# EAGLE design LatencyTester (EAGLE 6.5.0)
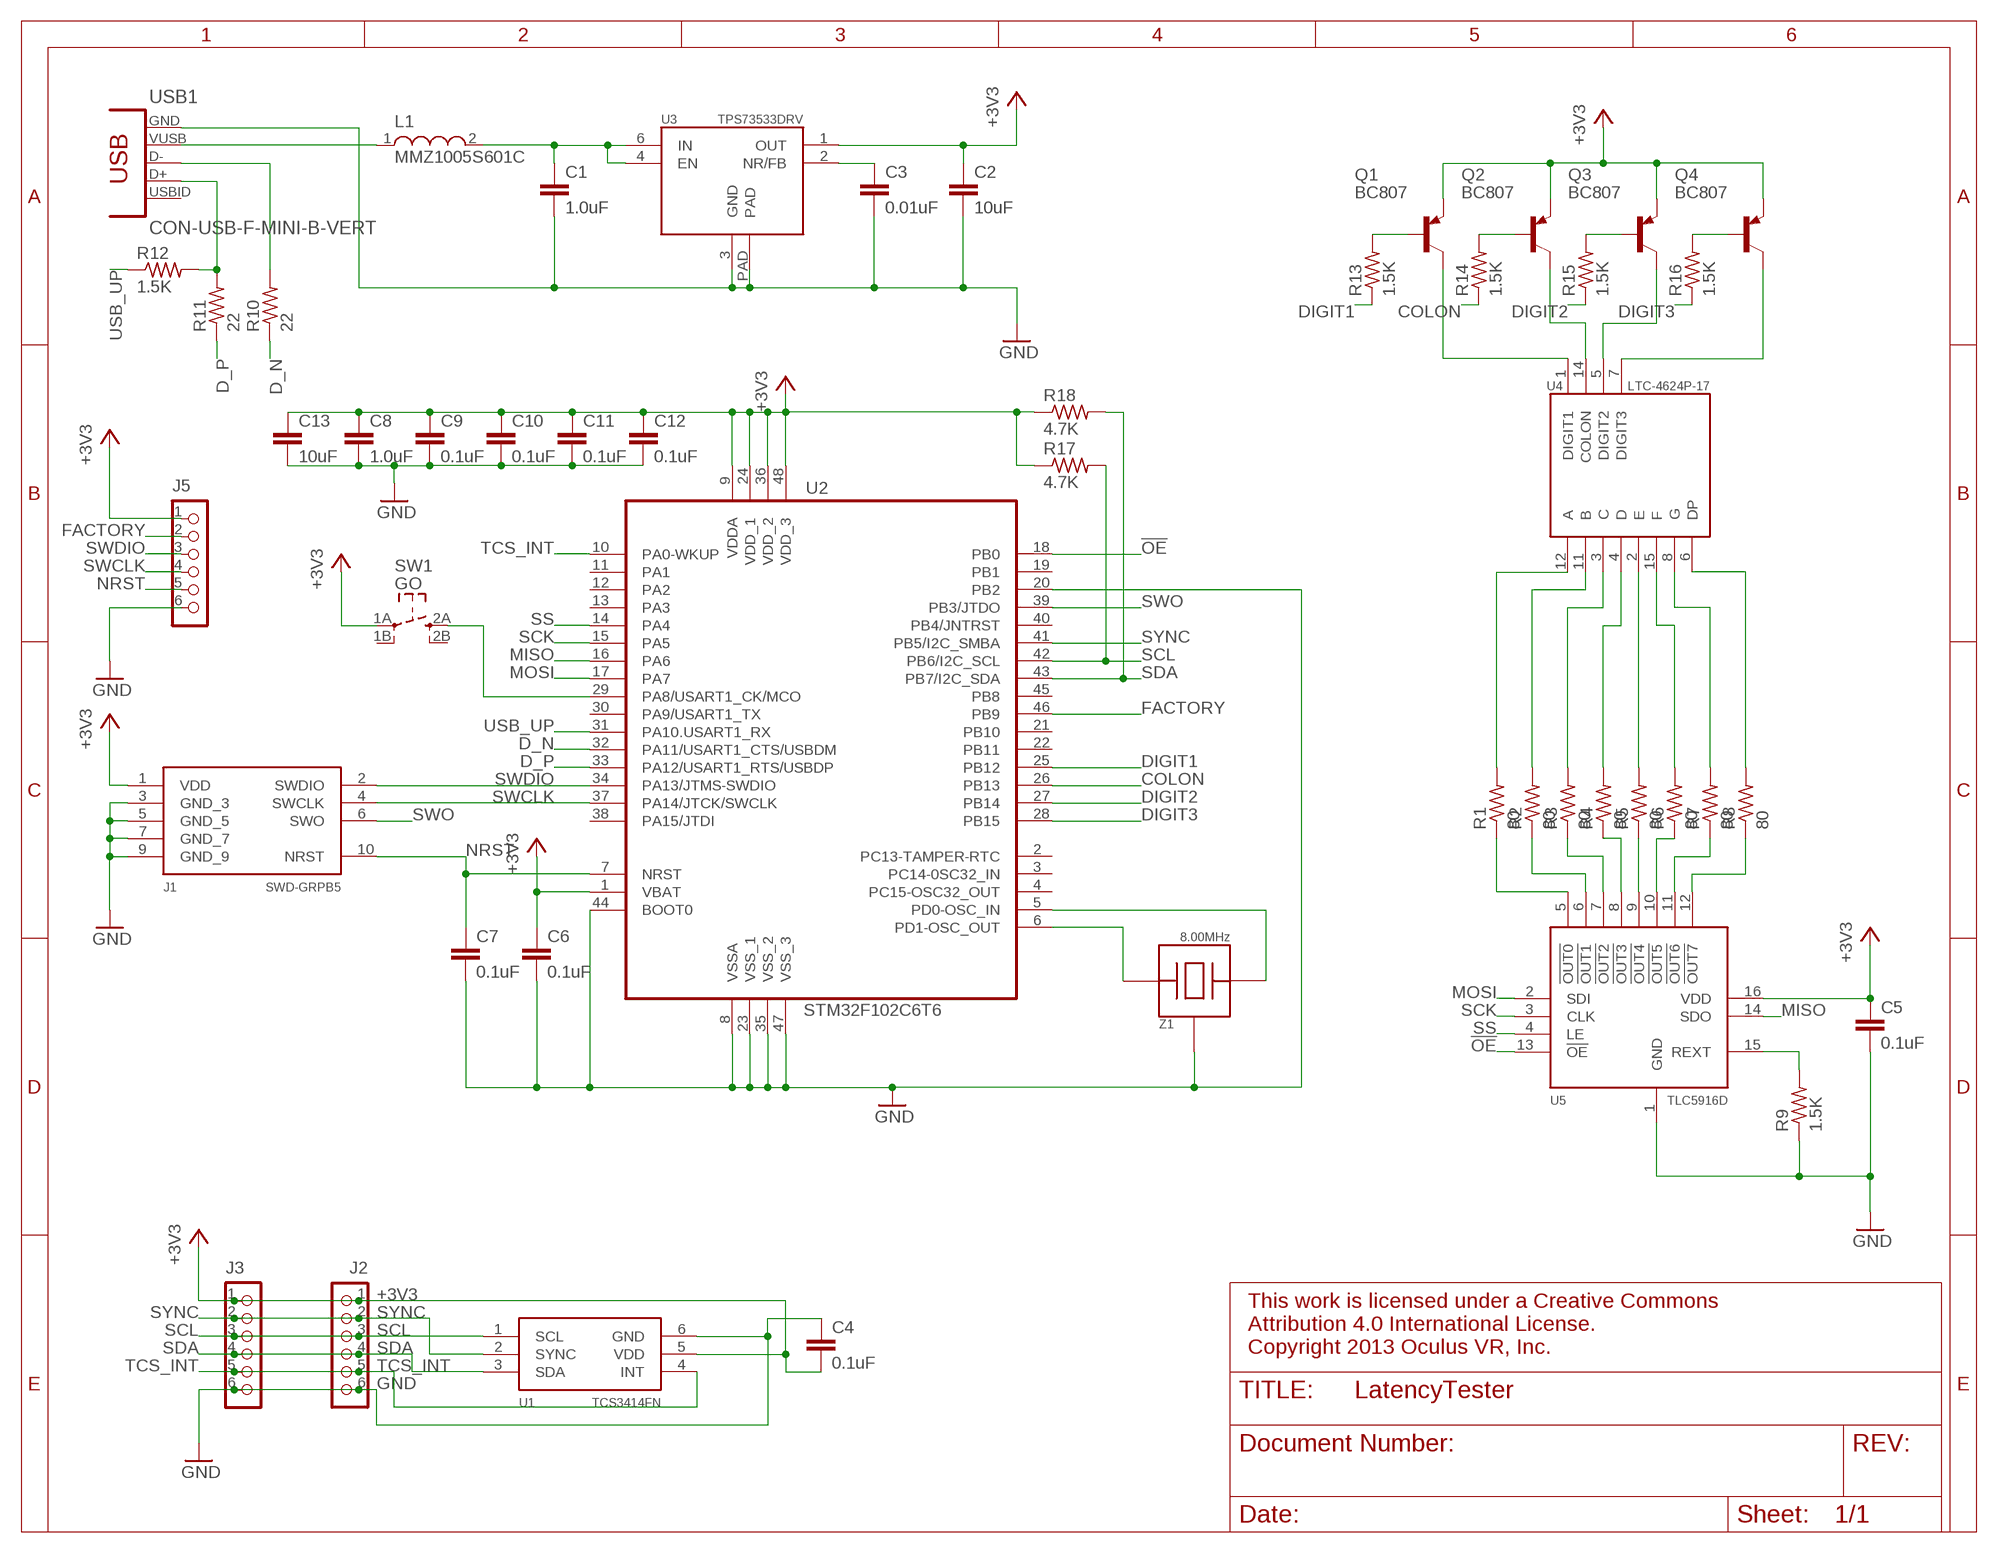
[diagram p0: schematic, sheet 1]

## Parts
C1  1.0uF  C-EUC0402  [C0402]
C2  10uF  C-EUC0805  [C0805]
C3  0.01uF  C-EUC0402  [C0402]
C4  0.1uF  C-EUC0402  [C0402]
C5  0.1uF  C-EUC0402  [C0402]
C6  0.1uF  C-EUC0402  [C0402]
C7  0.1uF  C-EUC0402  [C0402]
C8  1.0uF  C-EUC0402  [C0402]
C9  0.1uF  C-EUC0402  [C0402]
C10  0.1uF  C-EUC0402  [C0402]
C11  0.1uF  C-EUC0402  [C0402]
C12  0.1uF  C-EUC0402  [C0402]
C13  10uF  C-EUC0805  [C0805]
J1  SWD-GRPB5  [GRPB5]
J2  CON_HEADER_1X06-PTH  [M1X6]
J3  CON_HEADER_1X06-PTH  [M1X6]
J5  CON_HEADER_1X06-PTH  [M1X6]
L1  MMZ1005S601C  INDUCTOR-L0402  [C402]
Q1  BC807  TRANSISTOR_BJT_PNP-SOT-323  [SOT-323]
Q2  BC807  TRANSISTOR_BJT_PNP-SOT-323  [SOT-323]
Q3  BC807  TRANSISTOR_BJT_PNP-SOT-323  [SOT-323]
Q4  BC807  TRANSISTOR_BJT_PNP-SOT-323  [SOT-323]
R1  80  R-US_R0402  [R0402]
R2  80  R-US_R0402  [R0402]
R3  80  R-US_R0402  [R0402]
R4  80  R-US_R0402  [R0402]
R5  80  R-US_R0402  [R0402]
R6  80  R-US_R0402  [R0402]
R7  80  R-US_R0402  [R0402]
R8  80  R-US_R0402  [R0402]
R9  1.5K  R-US_R0402  [R0402]
R10  22  R-US_R0402  [R0402]
R11  22  R-US_R0402  [R0402]
R12  1.5K  R-US_R0402  [R0402]
R13  1.5K  R-US_R0402  [R0402]
R14  1.5K  R-US_R0402  [R0402]
R15  1.5K  R-US_R0402  [R0402]
R16  1.5K  R-US_R0402  [R0402]
R17  4.7K  R-US_R0402  [R0402]
R18  4.7K  R-US_R0402  [R0402]
SW1  GO  SW_TACT_4P-ADTS2  [ADTS2]
U1  TCS3414FN  [TCS3414FN]
U2  STM32F102C6T6  IC_UC_STM32  [LQFP48]
U3  TPS73533DRV  TPS735XXDRV  [SON-6]
U4  LTC-4624P-17  [LTC-4624]
U5  TLC5916D  [SOIC-16]
USB1  CON-USB-F-MINI-B-VERT  [651005136421]
Z1  8.00MHz  RESONATOR-PQRV-C  [PQRV]

## Nets
!OE: U2.18(PB0) U5.13(!OE)
+3V3: C2.1 C4.2 C5.1 C6.1 C8.1 C9.1 C10.1 C11.1 C12.1 C13.1 J1.1(VDD) J2.1 J3.1 J5.1 Q1.2(E) Q2.2(E) Q3.2(E) Q4.2(E) R17.1 R18.1 SW1.1A U1.5(VDD) U2.1(VBAT) U2.9(VDDA) U2.24(VDD_1) U2.36(VDD_2) U2.48(VDD_3) U3.1(OUT) U5.16(VDD)
COLON: R14.1 U2.26(PB13)
D1_N: R10.2 USB1.2(D-)
D1_P: R11.2 R12.2 USB1.3(D+)
D_N: R10.1 U2.32(PA11/USART1_CTS/USBDM)
D_P: R11.1 U2.33(PA12/USART1_RTS/USBDP)
DIGIT1: R13.1 U2.25(PB12)
DIGIT2: R15.1 U2.27(PB14)
DIGIT3: R16.1 U2.28(PB15)
FACTORY: J5.2 U2.46(PB9)
GND: C1.2 C2.2 C3.2 C4.1 C5.2 C6.2 C7.2 C8.2 C9.2 C10.2 C11.2 C12.2 C13.2 J1.3(GND_3) J1.5(GND_5) J1.7(GND_7) J1.9(GND_9) J2.6 J3.6 J5.6 R9.1 U1.6(GND) U2.8(VSSA) U2.20(PB2) U2.23(VSS_1) U2.35(VSS_2) U2.44(BOOT0) U2.47(VSS_3) U3.3(GND) U3.PAD U5.1(GND) USB1.5(GND) Z1.2(GND)
MISO: U2.16(PA6) U5.14(SDO)
MOSI: U2.17(PA7) U5.2(SDI)
N$1: R1.1 U5.5(!OUT0)
N$2: R2.1 U5.6(!OUT1)
N$3: R3.1 U5.7(!OUT2)
N$4: R4.1 U5.8(!OUT3)
N$5: R5.1 U5.9(!OUT4)
N$6: R6.1 U5.10(!OUT5)
N$7: R7.1 U5.11(!OUT6)
N$8: R8.1 U5.12(!OUT7)
N$9: R1.2 U4.12(A)
N$10: R2.2 U4.11(B)
N$11: R3.2 U4.3(C)
N$12: R4.2 U4.4(D)
N$13: R5.2 U4.2(E)
N$14: R6.2 U4.15(F)
N$15: R7.2 U4.8(G)
N$16: R8.2 U4.6(DP)
N$17: U2.6(PD1-OSC_OUT) Z1.1(IN)
N$18: U2.5(PD0-OSC_IN) Z1.3(OUT)
N$19: Q1.3(C) U4.1(DIGIT1)
N$20: Q2.3(C) U4.14(COLON)
N$21: Q3.3(C) U4.5(DIGIT2)
N$22: Q4.3(C) U4.7(DIGIT3)
N$24: SW1.2A U2.29(PA8/USART1_CK/MCO)
N$25: C3.1 U3.2(NR/FB)
N$26: R9.2 U5.15(REXT)
N$33: Q1.1(B) R13.2
N$34: Q2.1(B) R14.2
N$35: Q3.1(B) R15.2
N$36: Q4.1(B) R16.2
NRST: C7.1 J1.10(NRST) J5.5 U2.7(NRST)
SCK: U2.15(PA5) U5.3(CLK)
SCL: J2.3 J3.3 R17.2 U1.1(SCL) U2.42(PB6/I2C_SCL)
SDA: J2.4 J3.4 R18.2 U1.3(SDA) U2.43(PB7/I2C_SDA)
SS: U2.14(PA4) U5.4(LE)
SWCLK: J1.4(SWCLK) J5.4 U2.37(PA14/JTCK/SWCLK)
SWDIO: J1.2(SWDIO) J5.3 U2.34(PA13/JTMS-SWDIO)
SWO: J1.6(SWO) U2.39(PB3/JTDO)
SYNC: J2.2 J3.2 U1.2(SYNC) U2.41(PB5/I2C_SMBA)
TCS_INT: J2.5 J3.5 U1.4(INT) U2.10(PA0-WKUP)
USB_UP: R12.1 U2.31(PA10.USART1_RX)
VUSB: L1.1 USB1.1(VUSB)
VUSB_FILTERED: C1.1 L1.2 U3.4(EN) U3.6(IN)
Unconnected: SW1.1B SW1.2B U2.2(PC13-TAMPER-RTC) U2.3(PC14-0SC32_IN) U2.4(PC15-OSC32_OUT) U2.11(PA1) U2.12(PA2) U2.13(PA3) U2.19(PB1) U2.21(PB10) U2.22(PB11) U2.30(PA9/USART1_TX) U2.38(PA15/JTDI) U2.40(PB4/JNTRST) U2.45(PB8) USB1.4(USBID)

## Notes on the sheet
- This work is licensed under a Creative Commons 
  Attribution 4.0 International License.
  Copyright 2013 Oculus VR, Inc.

## Library data of the parts
C1-C13 = resistor:C-EU: CAPACITOR, European symbol
J1 = oculus:SWD
J2 J3 J5 = dp_devices:CON_HEADER_1X06
L1 = oculus:INDUCTOR: Inductor
Q1-Q4 = oculus:TRANSISTOR_BJT_PNP: From Dangerous Prototypes Most commonly used is SOT23-BEC
R1-R18 = resistor:R-US_: RESISTOR, American symbol
SW1 = oculus:SW_TACT_4P
U1 = oculus:TCS3414: TAOS Digital Color Sensor
U2 = dp_devices:IC_UC_STM32: STM32F102C6
U3 = oculus:TPS735XX: Texas Instruments 500mA, Low Quiescent Current, Ultra-Low Noise, High PSRR Low-Dropout Linear Regulator
U4 = oculus:LTC-4624: LITE-ON triple digit seven-segment display.
U5 = oculus:TLC5916: TI 8-channel constant-current led sink drivers.
USB1 = oculus:CON-USB-F: USB Female connector
Z1 = oculus:RESONATOR

## Net classes
0 default: clearance 0.355 mm

## Board
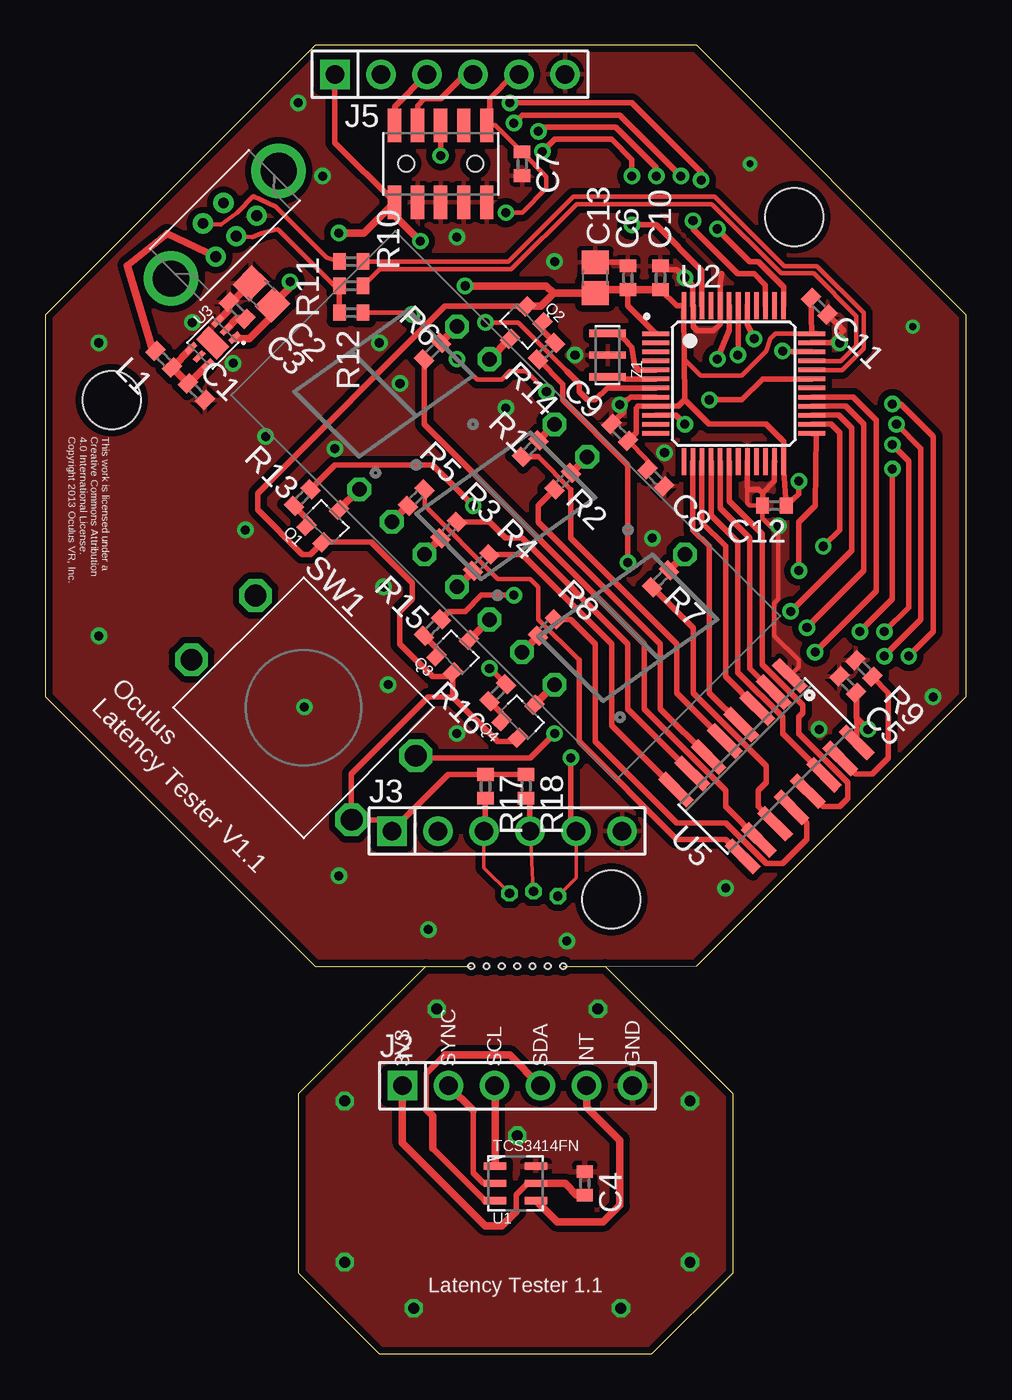
[diagram p1: board, top side]
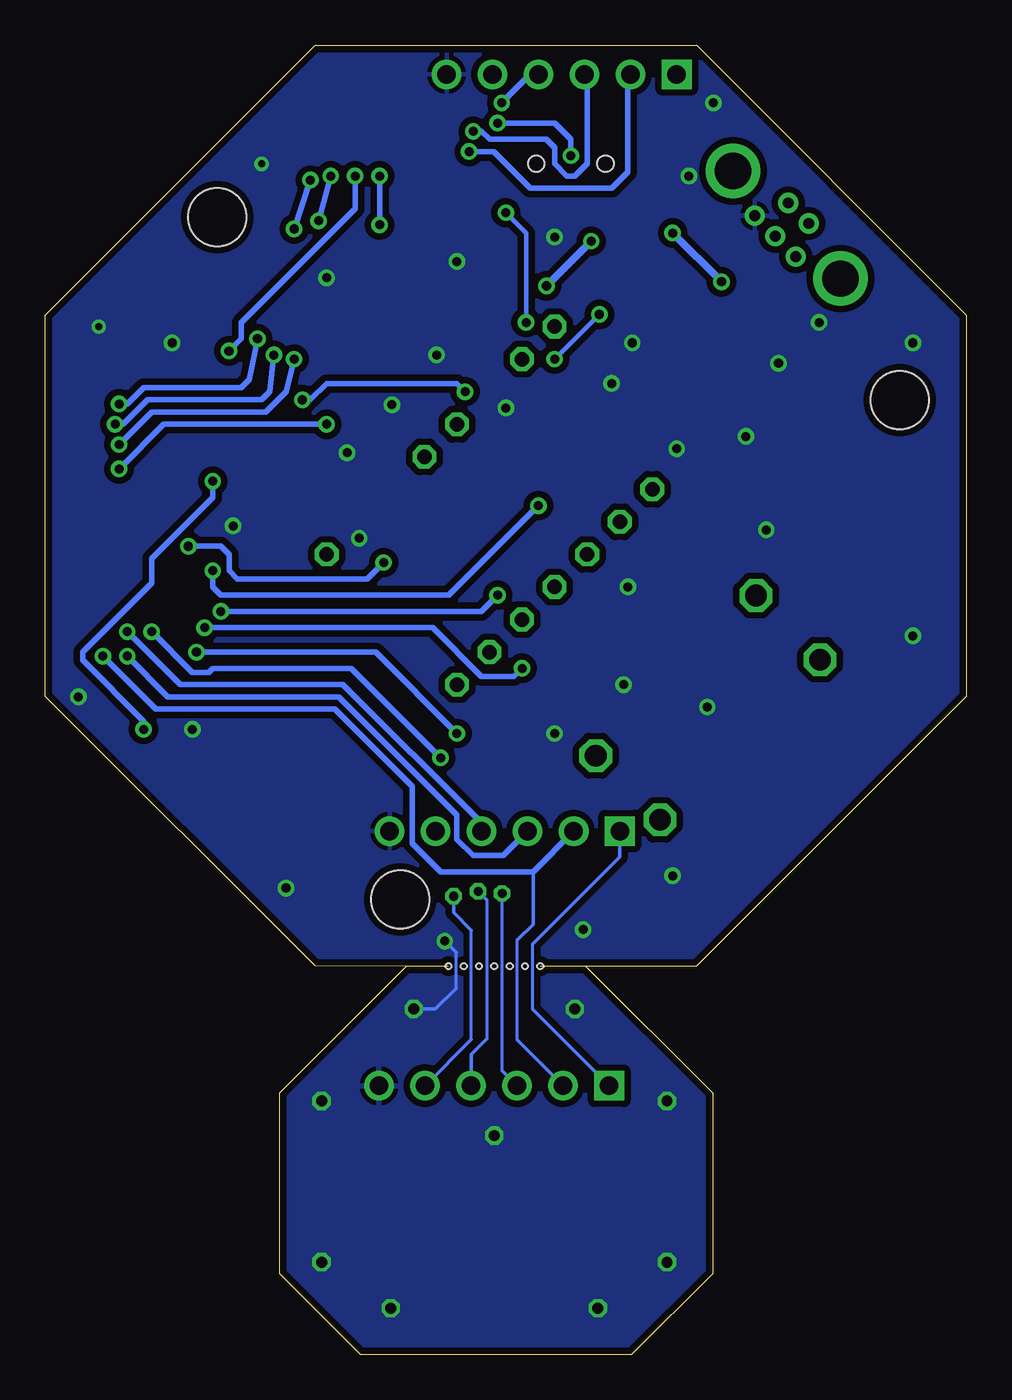
[diagram p2: board, bottom side, seen from below]

Size 50.8 x 72.22 mm. Coordinates in mm from the lower left corner, seen from the top.
Outline: 21,21.41 14.89,21.41 0,36.3 0,57.35 14.88,72.22 35.92,72.22 50.8,57.35 50.8,36.3 35.92,21.42 28.56,21.41 30.88,21.41 37.91,14.38 37.91,4.47 33.43,0 18.44,0 13.97,4.47 13.97,14.38 20.98,21.4 21,21.41
Outline: 21,21.41 23.49,21.41
Copper layers (1*16): Top 0.035559375mm / dielectric 1.501140625mm / Bottom 0.035559375mm
Design rules "typical_4pcb": minimum track width 10mil, minimum drill 15mil, track to track 6mil, track to pad 6mil, pad to pad 6mil, via to via 6mil, smd to smd 6mil, copper to edge 15mil, drill to drill 8mil, minimum pad ring 10mil, minimum via ring 8mil, stop-mask expansion 4mil, vias tented up to drill 0mil, thermal gap 10mil
Holes 0.33 mm at 26.03,21.41 26.87,21.41 25.18,21.41 24.34,21.41 23.49,21.41 28.56,21.41 27.72,21.41

### Footprints (pad centres in the part's own frame; a part is rotated, then mirrored left to right if it is on the bottom)
C0402 = smd 0.7 x 0.9: 1 -0.65,0; 2 0.65,0
C0805 = smd 1.3 x 1.5: 1 -0.85,0; 2 0.85,0
GRPB5 = smd 0.737 x 1.854: 1 -2.54,-2.121; 2 -2.54,2.121; 3 -1.27,-2.121; 4 -1.27,2.121; 5 0,-2.121; 6 0,2.121; 7 1.27,-2.121; 8 1.27,2.121; 9 2.54,-2.121; 10 2.54,2.121 | hole 0.9: -1.905,0; 1.905,0
M1X6 = drill 1.02 pad 1.632 square: 1 0,0 | drill 1.02 pad 1.632: 2 2.54,0; 3 5.08,0; 4 7.62,0; 5 10.16,0; 6 12.7,0
C402 = smd 0.7 x 0.9: 1 -0.65,0; 2 0.65,0
SOT-323 = smd 0.711 x 0.889: 1 -0.635,-0.953; 2 0.635,-0.953; 3 0,0.953
R0402 = smd 0.7 x 0.9: 1 -0.65,0; 2 0.65,0
ADTS2 = drill 1.2 octagon: 1A -6.248,2.502; 1B 6.248,2.502; 2A -6.248,-2.502; 2B 6.248,-2.502
TCS3414FN = smd 1.25 x 0.4: 1 -1.125,0.95; 2 -1.125,0; 3 -1.125,-0.95; 4 1.125,-0.95; 5 1.125,0; 6 1.125,0.95
LQFP48 = smd 1.5 x 0.25: 1 -4.3,2.75; 2 -4.3,2.25; 3 -4.3,1.75; 4 -4.3,1.25; 5 -4.3,0.75; 6 -4.3,0.25; 7 -4.3,-0.25; 8 -4.3,-0.75; 9 -4.3,-1.25; 10 -4.3,-1.75; 11 -4.3,-2.25; 12 -4.3,-2.75; 25 4.3,-2.75; 26 4.3,-2.25; 27 4.3,-1.75; 28 4.3,-1.25; 29 4.3,-0.75; 30 4.3,-0.25; 31 4.3,0.25; 32 4.3,0.75; 33 4.3,1.25; 34 4.3,1.75; 35 4.3,2.25; 36 4.3,2.75 | smd 0.25 x 1.5: 13 -2.75,-4.3; 14 -2.25,-4.3; 15 -1.75,-4.3; 16 -1.25,-4.3; 17 -0.75,-4.3; 18 -0.25,-4.3; 19 0.25,-4.3; 20 0.75,-4.3; 21 1.25,-4.3; 22 1.75,-4.3; 23 2.25,-4.3; 24 2.75,-4.3; 37 2.75,4.3; 38 2.25,4.3; 39 1.75,4.3; 40 1.25,4.3; 41 0.75,4.3; 42 0.25,4.3; 43 -0.25,4.3; 44 -0.75,4.3; 45 -1.25,4.3; 46 -1.75,4.3; 47 -2.25,4.3; 48 -2.75,4.3
SON-6 = smd 0.7 x 0.3: 1 -1.05,0.65; 2 -1.05,0; 3 -1.05,-0.65; 4 1.05,-0.65; 5 1.05,0; 6 1.05,0.65 | smd 1 x 1.6: PAD 0,0
LTC-4624 = drill 0.8 octagon: 1 -6.35,-5.08; 2 -3.81,-5.08; 3 -1.27,-5.08; 4 1.27,-5.08; 5 3.81,-5.08; 6 6.35,-5.08; 7 8.89,-5.08; 8 8.89,5.08; 11 1.27,5.08; 12 -1.27,5.08; 14 -6.35,5.08; 15 -8.89,5.08
SOIC-16 = smd 0.6 x 2.2: 1 -4.445,-2.6; 2 -3.175,-2.6; 3 -1.905,-2.6; 4 -0.635,-2.6; 5 0.635,-2.6; 6 1.905,-2.6; 7 3.175,-2.6; 8 4.445,-2.6; 9 4.445,2.6; 10 3.175,2.6; 11 1.905,2.6; 12 0.635,2.6; 13 -0.635,2.6; 14 -1.905,2.6; 15 -3.175,2.6; 16 -4.445,2.6
HOLE_3.2 = hole 3.2: 0,0
651005136421 = drill 0.6: 1 1.6,0.9; 2 0.8,-0.9; 3 0,0.9; 4 -0.8,-0.9; 5 -1.6,0.9 | drill 2: TAB1 -4.2,0; TAB2 4.2,0
PQRV = smd 0.4 x 2: 1 -1.2,0; 2 0,0; 3 1.2,0

### Placement (x,y rotation side)
C1  8.34,53.11 315 top
C2  11.93,58.5 135 top
C3  10.58,57.6 135 top
C4  29.76,9.43 270 top
C5  44.26,36.95 135 top
C6  32.14,59.4 90 top
C7  26.3,65.68 270 top
C8  33.67,48.36 315 top
C9  31.69,50.87 135 top
C10  33.93,59.4 90 top
C11  42.69,57.83 315 top
C12  40.22,46.82 180 top
C13  30.34,59.4 90 top
J1  21.81,65.68 0 top
J2  19.69,14.81 0 top
J3  19.11,28.86 0 top
J5  15.97,70.62 0 top
L1  6.54,54.91 315 top
Q1  15.52,45.93 315 top
Q2  26.3,56.7 135 top
Q3  22.71,38.74 315 top
Q4  26.3,35.15 315 top
R1  26.75,49.97 45 top
R2  28.54,48.17 45 top
R3  22.26,45.48 225 top
R4  24.05,43.68 225 top
R5  20.46,47.27 225 top
R6  21.36,55.36 45 top
R7  33.93,42.78 45 top
R8  27.65,40.09 225 top
R9  45.16,37.84 315 top
R10  16.87,60.3 180 top
R11  16.87,58.95 180 top
R12  16.87,57.47 180 top
R13  14.17,47.27 225 top
R14  27.65,55.36 45 top
R15  21.36,40.09 225 top
R16  24.95,36.5 225 top
R17  24.28,31.33 270 top
R18  26.52,31.33 270 top
SW1  14.25,35.67 135 top
U1  25.94,9.43 0 top
U2  37.97,53.56 0 top
U3  9.24,55.81 225 top
U4  25.4,46.82 315 top
U5  39.77,32.46 225 top
U$1  [HOLE_3.2]  41.31,62.73 315 top
U$2  [HOLE_3.2]  3.67,52.65 315 top
U$3  [HOLE_3.2]  31.22,25.09 315 top
USB1  9.9,62.32 225 top
Z1  31.01,55.13 90 top

### Tracks (layer width: path | path; a pad name or v marks a point on that pad's centre or on a via)
!OE
  Top 0.305: U2.18 37.72,47.07 39.54,45.25 39.54,38.07 41.79,35.82 41.79,35.37 41.56,35.15 41.56,34.25 44.26,31.56 44.26,30.66 43.81,30.21 42.91,30.21 U5.13
+3V3  (via drill 0.5)
  Top 0.254: C9.1 33.21,49.34 C8.1 | U2.36 40.27,56.31 39.99,56.03 39.77,55.36 38.42,54.01 36.15,54.01 35.25,54.91
  Top 0.305: U5.16 44.75,36.45 C5.1 44.72,35.14 v45.38,34.48 | C10.1 34.82,57.86 U2.48 35.25,54.91 35.28,52.66 | 42.54,56.31 U2.36 C11.1 | U2.1 32.13,57.85 C6.1 | 35.28,52.66 34.93,52.31 U2.9 32.68,52.31 32.58,52.21 32.58,50.84 C9.1 | 22.48,36.27 Q3.2 22.26,37.4 21.36,37.4 19.56,39.19 19.56,40.99 20.24,41.66 20.24,42.56 17.99,44.8 Q1.2 14.62,44.13 14.17,44.13 11.7,46.6 11.7,47.5 22.03,57.83 Q2.2 | Q4.2 25.85,33.8 24.95,33.8 22.48,36.27 | 35.28,52.66 36.62,51.31 39.77,51.31 40.72,50.36 U2.24 40.72,48.77 C12.1 41.56,47.47 v41.56,48.17 | 22.48,36.27 21.13,36.27 16.87,32.01 16.87,29.52 SW1.1A 18.49,29.49 J3.1 22.23,31.98 R17.1 R18.1 | J5.1 15.97,66.86 J1.1 | 26.62,9.43 25.98,8.79 25.98,7.9
  Top 0.406: C10.1 C6.1 30.54,58.75 C13.1 28.05,58.55 | U3.1 10.5,56.03 11.26,56.03 12.53,57.3 C2.1 13.5,58.87 v13.5,59.17 | v16.19,61.87 17.57,61.87 J1.1 19.27,62.83 v20.68,61.42 | 28.05,58.55 27.32,57.83 Q2.2 | v23.15,58.95 27.64,58.95 28.05,58.55 | C4.2 29.32,8.77 28.67,9.43 U1.5 26.62,9.43 | 25.98,7.9 25.17,7.09 24.28,7.09 19.69,11.67 J2.1
  Bottom 0.152: 23.91,19.03 23.91,22.63
  Bottom 0.203: J2.1 23.91,19.03 | 23.91,22.63 19.11,27.43 J3.1
  Bottom 0.305: v45.38,34.48 45.38,34.93 48.75,38.29 48.75,38.74 44.93,42.56 44.93,43.91 41.56,47.27 v41.56,48.17
  Bottom 0.406: v13.5,59.17 v16.19,61.87 | v20.68,61.42 v23.15,58.95
COLON  (via drill 0.5)
  Top 0.305: R14.1 28.54,53.54 28.54,52.66 32.13,49.07 v32.13,43.68 | v42.91,44.58 43.81,45.48 43.81,50.87 43.36,51.31 42.91,51.31 U2.26
  Bottom 0.305: v32.13,43.68 33.03,42.78 40.22,42.78 40.67,43.23 40.67,44.13 41.11,44.58 v42.91,44.58
D1_N
  Top 0.254: USB1.2 9.68,62.32 10.58,62.99 11.48,63.89 12.71,63.33 15.52,60.52 R10.2
D1_P
  Top 0.254: USB1.3 11.41,61.64 11.93,61.87 12.83,62.09 15.97,58.95 R11.2
  Top 0.305: R12.2 R11.2
D_N
  Top 0.254: R10.1 17.99,60.27 25.54,60.27 29.13,63.87 36.93,63.87 40.75,60.05 42.55,60.05 45.13,57.46 45.13,55.5 43.95,54.31 U2.32
D_P
  Top 0.254: R11.1 18.44,59.87 25.71,59.87 29.3,63.46 36.77,63.46 40.58,59.64 42.38,59.64 44.73,57.29 44.73,55.66 43.87,54.81 U2.33
DIGIT1  (via drill 0.5)
  Top 0.305: R13.1 15.97,49.07 21.36,49.07 v23.6,46.82 | v41.56,43.23 41.56,45.93 42.46,46.82 42.52,50.81 U2.25
  Bottom 0.305: v23.6,46.82 28.54,41.89 41.11,41.89 41.56,42.33 v41.56,43.23
DIGIT2  (via drill 0.5)
  Top 0.305: v41.11,40.99 44.48,44.35 44.48,51.09 43.76,51.81 U2.27 | R15.1 22.26,40.99 23.15,40.99 24.05,41.89 v25.85,41.89
  Bottom 0.305: v41.11,40.99 26.75,40.99 v25.85,41.89
DIGIT3  (via drill 0.5)
  Top 0.305: R16.1 24.97,37.4 v24.5,37.84 | v42.01,40.09 45.16,43.23 45.16,51.31 44.16,52.31 U2.28
  Bottom 0.305: v24.5,37.84 24.95,37.4 26.75,37.4 29.44,40.09 v42.01,40.09
FACTORY  (via drill 0.5)
  Top 0.305: U2.46 36.22,59.8 33.71,62.32 v32.36,62.32 | v32.36,65.01 32.36,65.91 31.24,67.03 28.09,67.03 v27.42,66.36
  Bottom 0.305: v32.36,62.32 v32.36,65.01 | v27.42,66.36 26.07,66.36 24.05,64.34 19.56,64.34 18.66,65.23 18.66,70.47 J5.2
GND  (via drill 0.38, 0.5, 0.6)
  Top 0.254: U2.20 38.72,46.97 38.87,46.82 39.32,46.82 39.54,46.6 39.54,46.15 40.44,45.25 40.44,41.66 40.22,41.44 40.22,39.64 41.56,38.29 41.56,37.93 U5.1
  Top 0.305: C12.2 39.57,47.52 | 39.57,47.52 40.22,48.17 U2.23 | U2.20 38.72,47.87 38.87,47.72 39.37,47.72 39.57,47.52 | 30.14,60.05 C13.2 31.93,60.25 C6.2 | 37.3,59.62 37.22,59.1 U2.44 37.22,56.85 36.85,56.48 35.95,56.48 35.73,56.7 U2.47 35.72,58.95 34.83,59.85 34.13,59.85 C10.2 | C11.2 44.03,56.48 43.36,55.8 U2.35 | U2.8 32.28,52.81 v31.69,52.39 31.91,52.01 C9.2
  Top 0.406: C2.2 10.29,58.06 C3.2 10.12,57.61 U3.3
  Bottom 0.152: 28.14,20.19 28.14,22.18
  Bottom 0.203: v30.48,19.05 29.29,19.05 28.14,20.19 | 28.14,22.18 v28.77,22.8
  other vias: 18.42,55.81 13.95,69.05 15.3,65.01 37.52,25.72 48.97,36.27 16.2,26.39 2.95,39.64 2.95,55.81 19.56,53.56 15.97,49.97 22.71,34.25 18.66,42.33 11.03,45.48 34.16,49.74 33.48,45.03 25.4,52.21 18.91,36.95 42.69,34.48 35.28,59.4 12.15,50.64 14.29,35.71 8.11,56.93 10.36,54.68 40.44,45.7 28.09,60.3 22.71,61.64 43.81,55.81 29.22,55.13 38.87,65.68 47.85,56.7 26.03,12.06 21.59,19.05 35.56,13.97 35.56,5.08 20.32,2.54 31.75,2.54 16.51,5.08 16.51,13.97 21.13,23.43
  pour Top (isolate 0.305): 0.03,57.38 14.85,72.19 35.95,72.19 50.77,57.38 50.77,36.27 35.95,21.46 14.85,21.46 0.03,36.27
  pour Bottom (isolate 0.305): 0.03,57.38 14.85,72.19 35.95,72.19 50.77,57.38 50.77,36.27 35.95,21.46 14.85,21.46 0.03,36.27
  pour Bottom: 13.97,4.45 13.97,14.61 20.95,21.59 31.11,21.59 38.1,14.61 38.1,4.45 33.65,0 18.41,0
  pour Top (isolate 0.305): 13.97,4.45 13.97,14.61 20.95,21.59 31.11,21.59 38.1,14.61 38.1,4.45 33.65,0 18.41,0
MISO
  Top 0.305: U2.16 36.72,46.28 38.2,44.8 38.2,37.62 40.67,35.15 40.67,34.25 U5.14
MOSI
  Top 0.305: U2.17 37.22,46.68 38.87,45.03 38.87,37.84 U5.2
N$1
  Top 0.254: 28.99,47.72 27.2,49.52
  Top 0.305: U5.5 34.83,36.5 34.83,39.19 28.99,45.03 28.99,47.72 | 27.2,49.52 26.3,49.52 R1.1
N$2
  Top 0.305: U5.6 33.93,35.6 33.93,39.19 27.2,45.93 27.2,46.82 R2.1
N$3
  Top 0.305: U5.7 32.13,35.6 32.13,39.19 26.3,45.03 25.4,45.03 24.5,45.93 R3.1
N$4
  Top 0.305: U5.8 31.24,34.7 31.24,39.19 26.3,44.13 24.52,44.13 R4.1
N$5
  Top 0.254: R5.1 20.92,46.81 24.95,42.78 26.75,42.78 27.2,42.33 27.2,40.54 29.44,38.29
  Top 0.305: 29.44,38.29 29.44,33.8 34.83,28.41 37.52,28.41 U5.9
N$6
  Top 0.305: R6.1 20.9,51.33 33.03,39.19 33.03,35.6 37.52,31.11 37.52,30.21 U5.10
N$7
  Top 0.305: R7.1 35.73,40.07 35.73,36.5 39.77,32.46 39.77,31.56 39.32,31.11 39.32,30.21 U5.11
N$8
  Top 0.305: R8.1 28.98,40.55 30.34,39.19 30.34,33.8 34.83,29.31 37.52,29.31 39.77,27.07 40.67,27.07 42.01,28.41 42.01,29.31 U5.12
N$9
  Top 0.406: U4.12 R1.2
N$10
  Top 0.406: U4.11 R2.2
N$11
  Top 0.406: R3.2 U4.3
N$12
  Top 0.406: R4.2 U4.4
N$13
  Top 0.406: R5.2 U4.2
N$14
  Top 0.406: U4.15 R6.2
N$15
  Top 0.406: U4.8 R7.2
N$16
  Top 0.406: R8.2 U4.6
N$17
  Top 0.305: U2.6 31.94,53.81 31.61,53.93 Z1.1
N$18
  Top 0.305: U2.5 32.73,54.31 32.51,54.54 32.36,55.58 31.91,56.03 31.54,56.25 Z1.3
N$19
  Top 0.406: Q1.3 U4.1
N$20
  Top 0.406: U4.14 Q2.3
N$21
  Top 0.406: Q3.3 U4.5
N$22
  Top 0.406: Q4.3 U4.7
N$24  (via drill 0.5)
  Top 0.305: U2.29 44.56,52.81 45.83,51.54 45.83,42.11 v42.46,38.74 | v28.09,34.25 26.75,32.91 20.64,32.91 SW1.2A
  Bottom 0.305: v42.46,38.74 32.58,38.74 v28.09,34.25
N$25
  Top 0.406: U3.2 10.57,57.14 C3.1
N$26
  Top 0.305: U5.15 44.71,32.01 45.61,32.01 46.5,32.91 46.5,36.5 R9.2
N$33
  Top 0.305: Q1.1 14.4,46.13 R13.2
N$34
  Top 0.305: Q2.1 27.42,56.5 R14.2
N$35
  Top 0.305: Q3.1 21.58,38.95 R15.2
N$36
  Top 0.305: Q4.1 25.17,35.35 R16.2
NRST  (via drill 0.5)
  Top 0.254: J1.10 24.83,67.8 C7.1 27.64,64.99 27.64,64.34 26.3,62.99 v25.4,62.99 | 28.77,54.23 26.07,56.93 v24.28,56.93
  Top 0.305: U2.7 30.99,53.31 30.34,52.66 29.89,52.66 29.44,53.11 29.44,53.56 28.77,54.23 | J5.5 25.85,70.62 24.5,69.28 24.5,67.96 J1.10
  Bottom 0.254: v24.28,56.93 24.28,61.87 v25.4,62.99
SCK
  Top 0.305: U2.15 36.22,45.88 37.52,44.58 37.52,37.4 U5.3
SCL  (via drill 0.5)
  Top 0.203: v25.61,25.43 24.19,26.84 J3.3
  Top 0.305: U2.42 38.22,56 v38.2,55.13 | v46.95,51.31 48.3,49.97 48.3,40.54 v46.28,38.52 | R17.2 24.28,28.95 J3.3
  Top 0.406: U1.1 24.81,14.77 J2.3
  Bottom 0.152: 25.61,15.64 v25.61,25.43
  Bottom 0.203: J2.3 25.61,15.64
  Bottom 0.305: v38.2,55.13 38.42,53.11 38.87,52.66 45.16,52.66 46.5,51.31 v46.95,51.31 | v46.28,38.52 44.03,36.27 34.6,36.27 28.09,29.76 28.09,28.41 27.2,27.52 25.54,27.52 J3.3
SDA  (via drill 0.5)
  Top 0.203: J3.4 26.75,28.85 v26.93,25.54
  Top 0.305: U2.43 37.72,56.5 v37.07,54.91 | v46.73,50.19 47.63,49.29 47.63,41.21 v46.28,39.86 | J3.4 26.73,30.47 R18.2 | 24.23,8.48 21.36,11.35 | 21,13.51 21,15.48 22.03,16.52
  Top 0.406: U1.3 24.23,8.48 | 21.36,11.35 21.36,13.15 21,13.51 | 22.03,16.52 25.61,16.52 J2.4
  Bottom 0.152: 26.45,25.07 26.45,17.4
  Bottom 0.203: v26.93,25.54 26.45,25.07 | 26.45,17.4 27.31,16.53 J2.4
  Bottom 0.305: v37.07,54.91 37.52,53.11 38.65,51.99 44.93,51.99 v46.73,50.19 | v46.28,39.86 43.36,36.95 34.38,36.95 26.73,29.3 J3.4
SS
  Top 0.305: U5.4 36.62,36.5 36.62,44.58 35.72,45.48 U2.14
SWCLK  (via drill 0.5)
  Top 0.305: J1.4 20.54,68.9 20.91,69.28 21.81,69.28 23.15,70.62 J5.4 | v25.62,69.05 32.36,69.05 36.18,65.23 v36.18,64.79 | v37.07,62.09 38.87,60.29 39.32,60.29 40.72,58.89 U2.37
  Bottom 0.305: J5.4 24.05,70.62 v25.62,69.05 | v36.18,64.79 v37.07,62.09
SWDIO  (via drill 0.5)
  Top 0.305: J1.2 19.27,68.84 J5.3 | U2.34 40.71,55.31 v40.67,55.36 | v33.71,65.01 33.71,65.46 31.46,67.7 27.42,67.7 v27.2,67.48
  Bottom 0.305: v40.67,55.36 39.99,56.03 39.99,56.93 33.71,63.21 v33.71,65.01 | v27.2,67.48 26.75,67.48 26.3,67.03 23.15,67.03 22.71,66.58 22.71,65.68 22.03,65.01 21.58,65.01 20.91,65.68 20.91,70.48 J5.3
SWO  (via drill 0.5)
  Top 0.305: v35.05,65.01 31.69,68.38 26.3,68.38 v25.85,67.93 | v21.81,66.13 J1.6 | v35.73,62.54 35.73,62.09 38.2,59.62 39.09,59.62 39.72,58.99 U2.39
  Bottom 0.305: v35.73,62.54 v35.05,65.01 | v25.85,67.93 22.71,67.93 21.81,67.03 v21.81,66.13
SYNC  (via drill 0.5)
  Top 0.305: U2.41 38.72,56.85 v39.09,56.03 | v46.73,52.44 47.18,52.44 48.97,50.64 48.97,39.86 v47.63,38.52 | U1.2 24.18,9.43 23.6,10.01 23.6,13.44
  Top 0.406: 23.6,13.44 J2.2
  Bottom 0.152: 24.76,17.34 24.76,22.86
  Bottom 0.203: J2.2 24.76,17.34 | 24.76,22.86 23.9,23.72 23.9,26.62
  Bottom 0.305: v39.09,56.03 39.54,53.78 39.99,53.34 45.38,53.34 46.28,52.44 v46.73,52.44 | v47.63,38.52 44.71,35.6 34.83,35.6 30.56,31.33 30.56,28.19 28.99,26.62 23.9,26.62 J3.2
TCS_INT  (via drill 0.5)
  Top 0.203: v28.27,25.27 29.27,26.27 J3.5 28.99,29.15
  Top 0.305: U2.10 34.78,51.81 v35.28,51.31 | v46.73,48.85 46.73,41.66 v44.93,39.86 | v28.99,32.91 28.99,29.15
  Top 0.406: U1.4 28.23,7.31 30.79,7.31 31.69,8.21 31.69,11.8 29.85,13.63 J2.5
  Bottom 0.152: 27.3,17.37 27.3,23.4
  Bottom 0.203: J2.5 27.3,17.37 | 27.3,23.4 28.27,24.37 v28.27,25.27
  Bottom 0.305: v35.28,51.31 44.26,51.31 v46.73,48.85 | v44.93,39.86 42.69,37.62 41.79,37.62 41.56,37.84 33.93,37.84 v28.99,32.91
USB_UP  (via drill 0.5)
  Top 0.254: v27.64,53.11 26.52,54.23 25.62,54.23 25.17,53.78 23.83,53.78 v22.71,54.91 | v20.24,57.38 20.14,57.47 R12.1
  Top 0.305: v36.62,52.66 38.42,52.66 39.57,53.81 U2.31
  Bottom 0.254: v22.71,54.91 v20.24,57.38
  Bottom 0.305: v27.64,53.11 28.09,53.56 35.28,53.56 36.18,52.66 v36.62,52.66
VUSB
  Top 0.406: USB1.1 6.72,61.82 4.52,60.07 5.87,55.58 L1.1
VUSB_FILTERED
  Top 0.406: U3.6 7.92,53.57 C1.1 L1.2 8.03,55.48 U3.4

### Text on the board
tNames: This work is licensed under a / Creative Commons Attribution / 4.0 International License. / Copyright 2013 Oculus VR, Inc. | Oculus / Latency Tester V1.1 | 3V3 | SYNC | SCL | SDA | INT | GND | Latency Tester 1.1
_tPlace: J5 | J3
_tNames: C7 | R10 | C13 | C6 | C10 | R11 | U2 | U3 | Q2 | R12 | R6 | C11 | C3 | C2 | L1 | C1 | Z1 | R14 | C9 | R5 | R1 | R13 | R3 | C8 | R2 | C12 | Q1 | R4 | R15 | R8 | SW1 | R7 | Q3 | R16 | R9 | Q4 | C5 | R17 | R18 | U5